# EAGLE schematic mosfer-board (EAGLE 9.3.1)
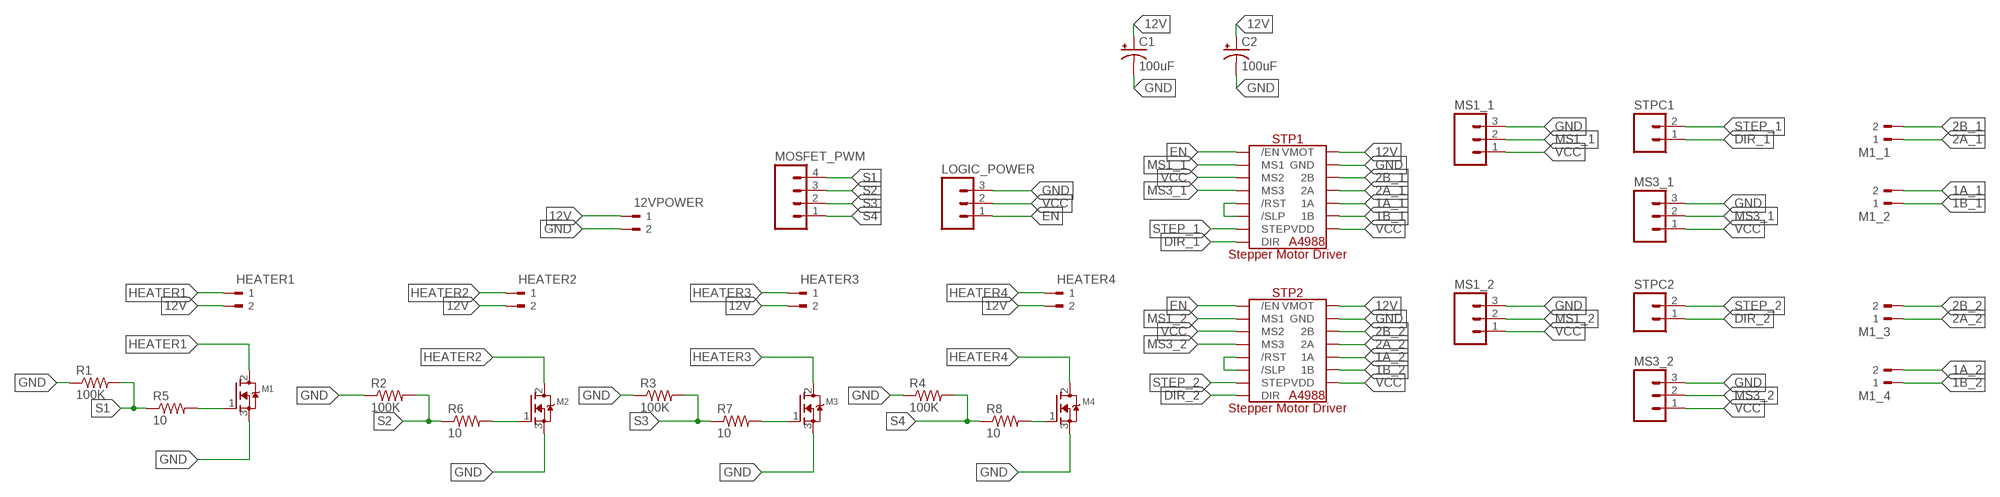
[diagram p0: schematic, sheet 1]

## Parts
12VPOWER  PM5.08/2/90BLK  [WEIDMULLER_PM5.08_2]
C1  100uF  100UF-POLAR-RADIAL-2.5MM-25V-20%  [CPOL-RADIAL-2.5MM-6.5MM]
C2  100uF  100UF-POLAR-RADIAL-2.5MM-25V-20%  [CPOL-RADIAL-2.5MM-6.5MM]
HEATER1  PM5.08/2/90BLK  [WEIDMULLER_PM5.08_2]
HEATER2  PM5.08/2/90BLK  [WEIDMULLER_PM5.08_2]
HEATER3  PM5.08/2/90BLK  [WEIDMULLER_PM5.08_2]
HEATER4  PM5.08/2/90BLK  [WEIDMULLER_PM5.08_2]
LOGIC_POWER  M03  [03P]
M1  MOSFET-NGDS_TO220V  [TO220V]
M1_1  PM5.08/2/90BLK  [WEIDMULLER_PM5.08_2]
M1_2  PM5.08/2/90BLK  [WEIDMULLER_PM5.08_2]
M1_3  PM5.08/2/90BLK  [WEIDMULLER_PM5.08_2]
M1_4  PM5.08/2/90BLK  [WEIDMULLER_PM5.08_2]
M2  MOSFET-NGDS_TO220V  [TO220V]
M3  MOSFET-NGDS_TO220V  [TO220V]
M4  MOSFET-NGDS_TO220V  [TO220V]
MOSFET_PWM  M04  [04P]
MS1_1  M03  [03P]
MS1_2  M03  [03P]
MS3_1  M03  [03P]
MS3_2  M03  [03P]
R1  100K  RES-US1206FAB  [R1206FAB]
R2  100K  RES-US1206FAB  [R1206FAB]
R3  100K  RES-US1206FAB  [R1206FAB]
R4  100K  RES-US1206FAB  [R1206FAB]
R5  10  RES-US1206FAB  [R1206FAB]
R6  10  RES-US1206FAB  [R1206FAB]
R7  10  RES-US1206FAB  [R1206FAB]
R8  10  RES-US1206FAB  [R1206FAB]
STP1  A4988_STEP  [A4988_STEP]
STP2  A4988_STEP  [A4988_STEP]
STPC1  M02  [02P]
STPC2  M02  [02P]

## Nets
1A_1: M1_2.2 STP1.1A
1A_2: M1_4.2 STP2.1A
1B_1: M1_2.1 STP1.1B
1B_2: M1_4.1 STP2.1B
2A_1: M1_1.1 STP1.2A
2A_2: M1_3.1 STP2.2A
2B_1: M1_1.2 STP1.2B
2B_2: M1_3.2 STP2.2B
12V: 12VPOWER.1 C1.1(+) C2.1(+) HEATER1.2 HEATER2.2 HEATER3.2 HEATER4.2 STP1.VMOT STP2.VMOT
DIR_1: STP1.DIR STPC1.1
DIR_2: STP2.DIR STPC2.1
EN: LOGIC_POWER.1 STP1./EN STP2./EN
GND: 12VPOWER.2 C1.2(-) C2.2(-) LOGIC_POWER.3 M1.3(S) M2.3(S) M3.3(S) M4.3(S) MS1_1.3 MS1_2.3 MS3_1.3 MS3_2.3 R1.1 R2.1 R3.1 R4.1 STP1.GND STP1.GND2(GND) STP2.GND STP2.GND2(GND)
HEATER1: HEATER1.1 M1.2(D)
HEATER2: HEATER2.1 M2.2(D)
HEATER3: HEATER3.1 M3.2(D)
HEATER4: HEATER4.1 M4.2(D)
MS1_1: MS1_1.2 STP1.MS1
MS1_2: MS1_2.2 STP2.MS1
MS3_1: MS3_1.2 STP1.MS3
MS3_2: MS3_2.2 STP2.MS3
N$1: STP1./RST STP1./SLP
N$2: STP2./RST STP2./SLP
N$3: M3.1(G) R7.2
N$4: M2.1(G) R6.2
N$5: M1.1(G) R5.2
N$6: M4.1(G) R8.2
S1: MOSFET_PWM.4 R1.2 R5.1
S2: MOSFET_PWM.3 R2.2 R6.1
S3: MOSFET_PWM.2 R3.2 R7.1
S4: MOSFET_PWM.1 R4.2 R8.1
STEP_1: STP1.STEP STPC1.2
STEP_2: STP2.STEP STPC2.2
VCC: LOGIC_POWER.2 MS1_1.1 MS1_2.1 MS3_1.1 MS3_2.1 STP1.MS2 STP1.VDD STP2.MS2 STP2.VDD

## Library data of the parts
12VPOWER HEATER1-HEATER4 M1_1-M1_4 = WEIDMULLER-PM5.08_2_90BLK:PM5.08/2/90BLK: TERMINAL BLOCK, SIDE ENTRY, 2WAY; MPN: PM5.08/2/90 BLK; OC_FARNELL: 1131855; OC_NEWARK: 26M1980; PACKAGE: TH-R/A; SUPPLIER: WEIDMULLER
C1 C2 = SparkFun-Capacitors:100UF-POLAR: 100µF polarized capacitors A capacitor is a passive two-terminal electrical component used to store electrical energy temporarily in an electric field.; PROD_ID: CAP-08439
LOGIC_POWER MS1_1 MS1_2 MS3_1 MS3_2 = con-amp-quick:M03: AMP QUICK CONNECTOR; OC_FARNELL: unknown; OC_NEWARK: unknown
M1-M4 = adafruit:MOSFET-N: N-Channel Mosfet 2N7002E - 60V 260mA SOT23 [Digikey: 2N7002ET1GOSTR-ND] - REEL BSH103 - 30V 850mA SOT23 [Digikey: 568-5013-1-ND]
MOSFET_PWM = con-amp-quick:M04: AMP QUICK CONNECTOR; OC_FARNELL: unknown; OC_NEWARK: unknown
R1-R8 = fab:RES-US: Resistor (US Symbol) Variants with postfix FAB are widened to allow the routing of internal traces
STP1 STP2 = IC:A4988_STEP
STPC1 STPC2 = con-amp-quick:M02: AMP QUICK CONNECTOR; OC_FARNELL: unknown; OC_NEWARK: unknown